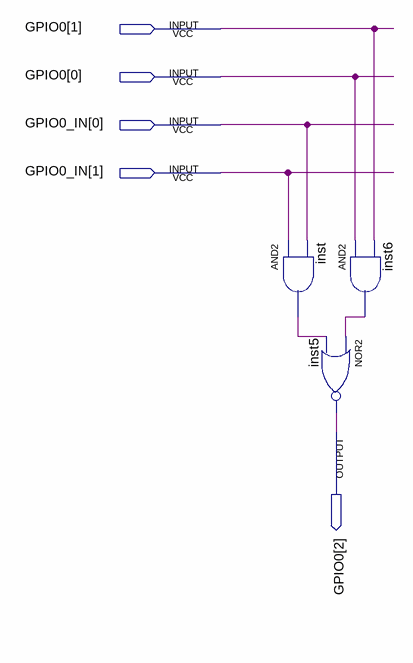
[diagram p0: schematic sheet]
// Quartus schematic 64LabOne.bdf as structural Verilog: 3 symbols, 5 pins
module \64LabOne  (
  inout  [2:0] GPIO0,
  input  [1:0] GPIO0_IN
);

  wire inst6_out, inst_out;

  and inst (inst_out, GPIO0_IN[1], GPIO0_IN[0]);
  and inst6 (inst6_out, GPIO0[0], GPIO0[1]);
  nor inst5 (GPIO0[2], inst6_out, inst_out);
endmodule
